# EasyEDA schematic 1-Schematic_Payload Controller.json
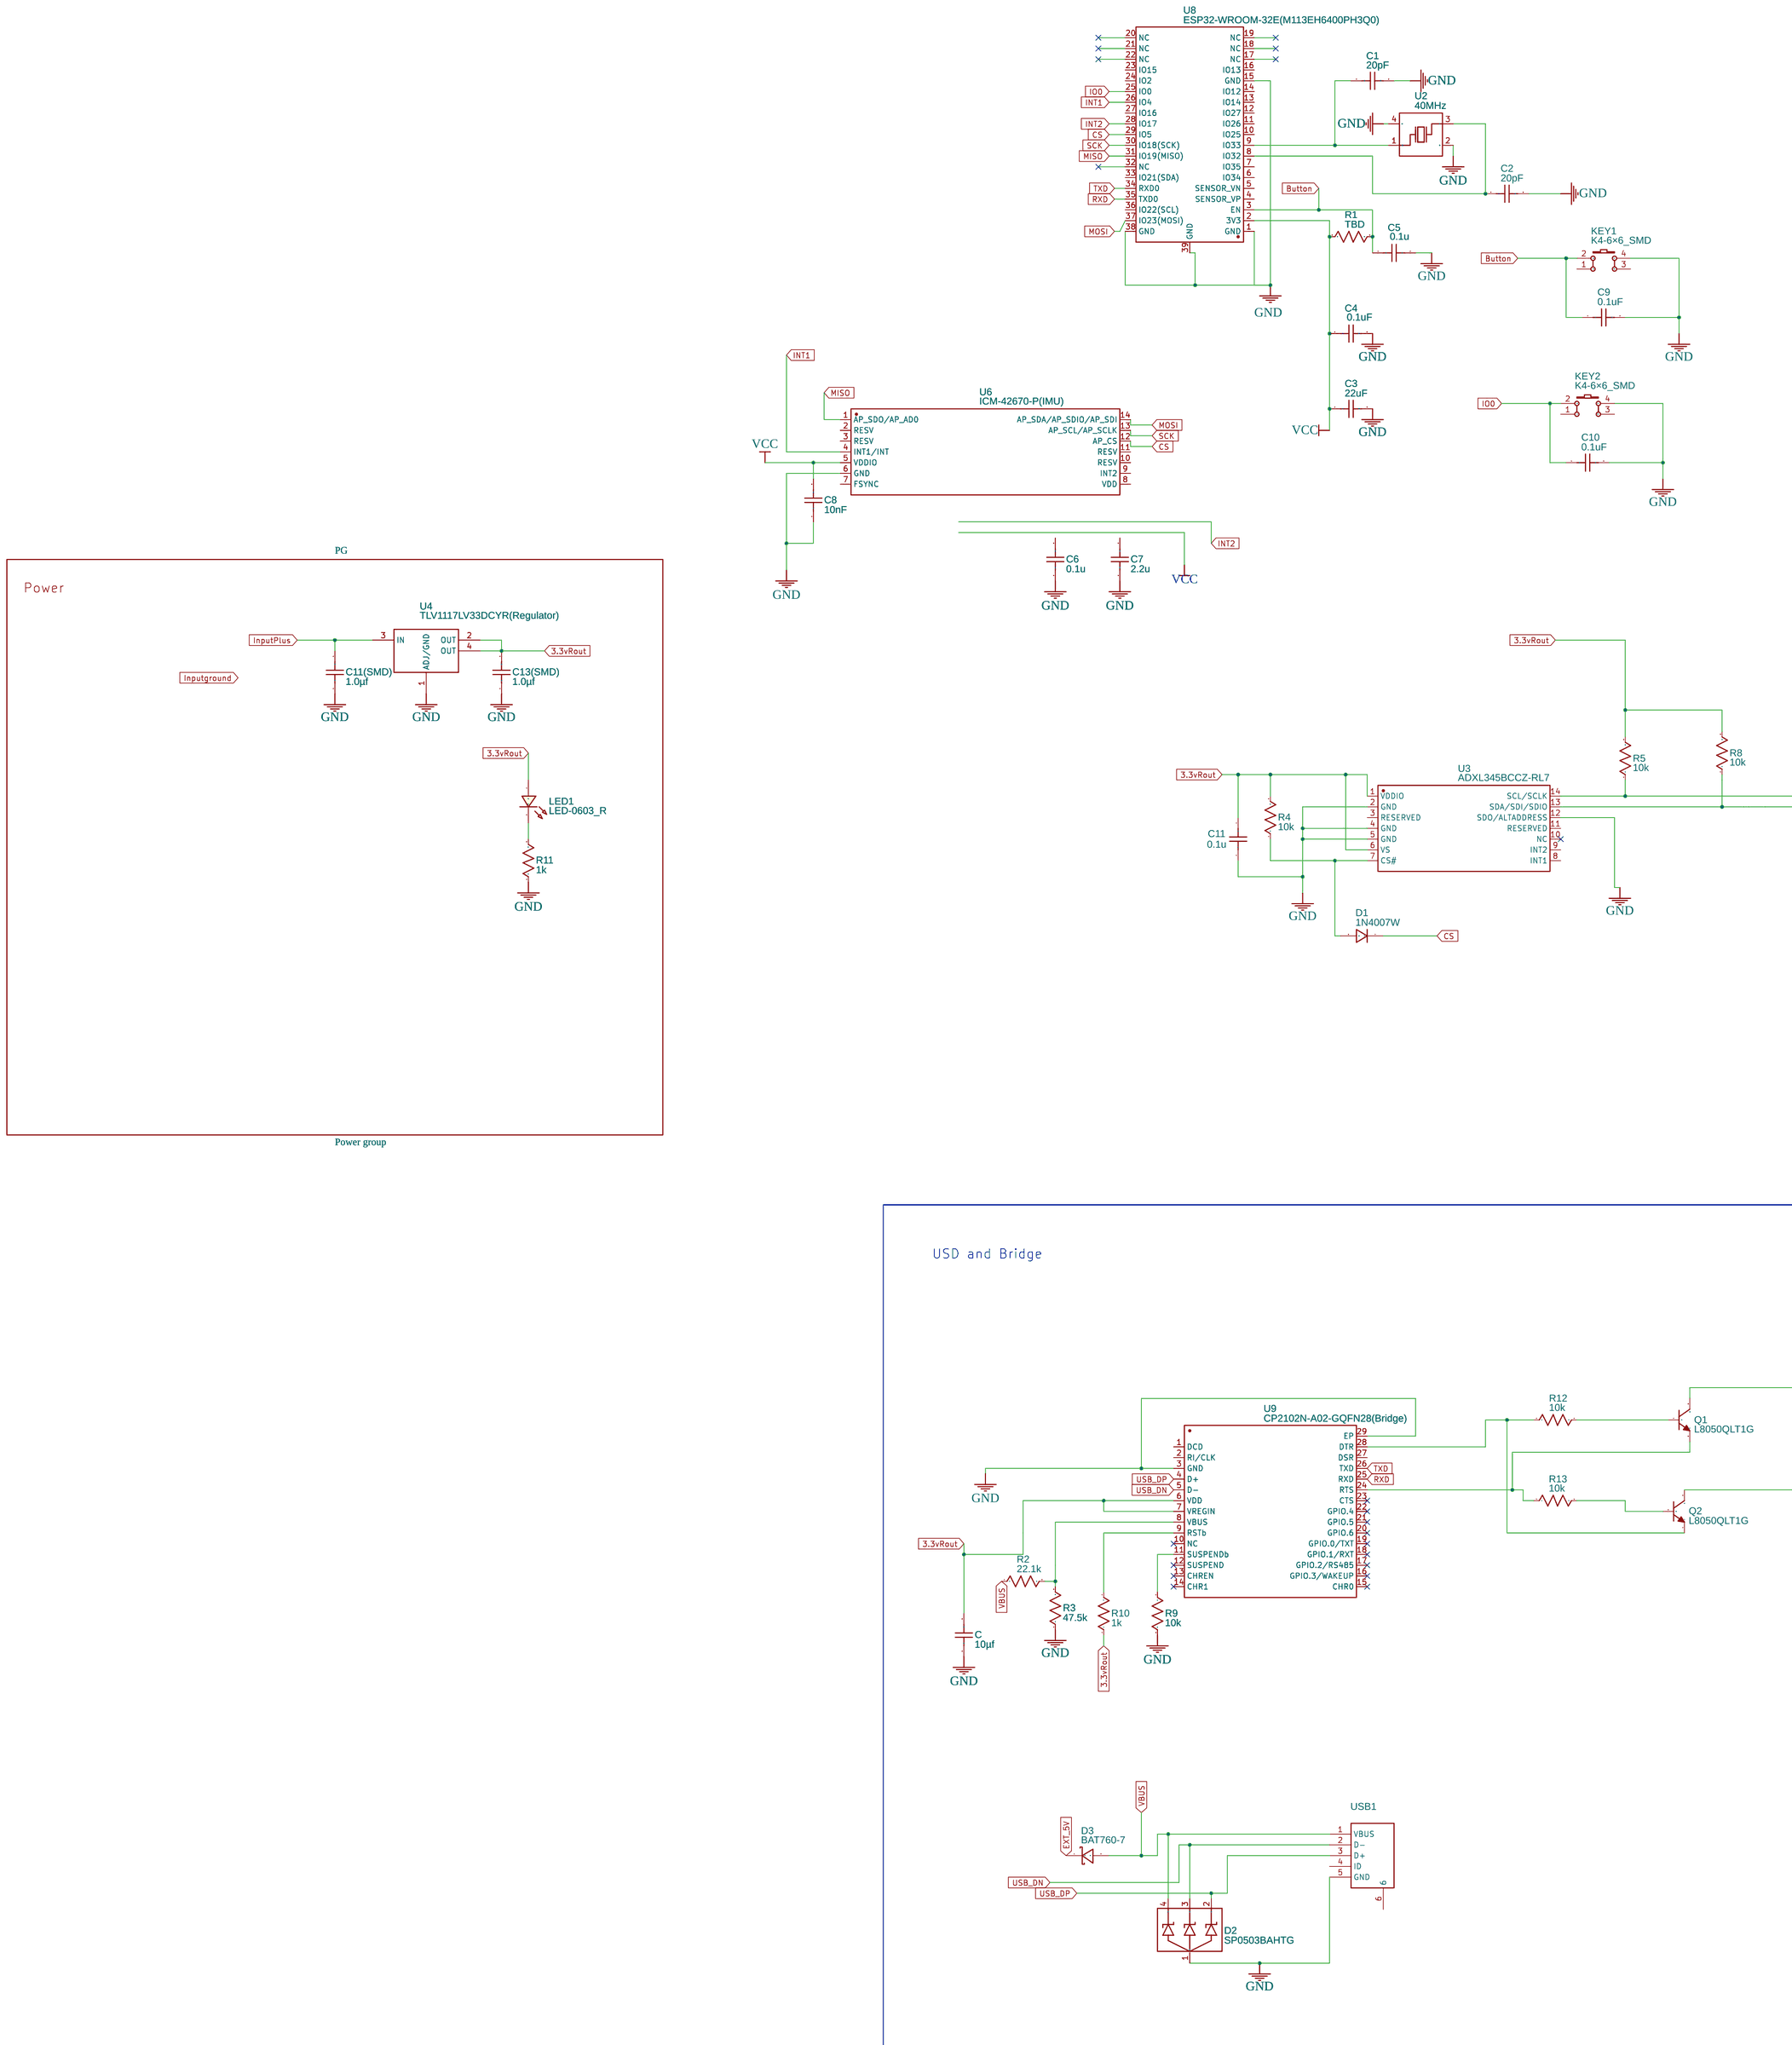
[diagram p0: schematic sheet]

## Parts
C  10µf  [C1206]
C1  20pF  [C0603]
C2  20pF  [C0603]
C3  22uF  [C0603]
C4  0.1uF  [C0603]
C5  0.1u  [C0603]
C6  0.1u  [C0603]
C7  2.2u  [C0603]
C8  10nF  [C0603]
C9  0.1uF  [C0603]
C10  0.1uF  [C0603]
C11  0.1u  [C0603]
C11(SMD)  1.0µf  [C1206]
C13(SMD)  1.0µf  [C1206]
D1  1N4007W  [SOD-123_L2.8-W1.8-LS3.7-RD]
D2  SP0503BAHTG  [SP0503BAHTG]
D3  BAT760-7  [SOD-323_L1.8-W1.3-LS2.5-RD]
KEY1  K4-6×6_SMD  [KEY-SMD_4P-L6.0-W6.0-P3.90-LS10.0]
KEY2  K4-6×6_SMD  [KEY-SMD_4P-L6.0-W6.0-P3.90-LS10.0]
LED1  LED-0603_R  [LED0603_RED]
PG  Power group
Q1  L8050QLT1G  [SOT-23-3_L2.9-W1.3-P1.90-LS2.4-BR]
Q2  L8050QLT1G  [SOT-23-3_L2.9-W1.3-P1.90-LS2.4-BR]
R1  TBD  [R0603]
R2  22.1k  [R1206]
R3  47.5k  [R1206]
R4  10k  [R1206]
R5  10k  [R1206]
R8  10k  [R1206]
R9  10k  [R1206]
R10  1k  [R1206]
R11  1k  [R1206]
R12  10k  [R1206]
R13  10k  [R1206]
U2  40MHz  [OSC-SMD_4P-L2.5-W2.0-BL]
U3  ADXL345BCCZ-RL7  [LGA-14_L5.0-W3.0-P0.80-BL]
U4  TLV1117LV33DCYR(Regulator)  [SOT-223_L6.7-W3.5-P2.30-BR]
U6  ICM-42670-P(IMU)  [LGA-14_L3.0-W2.5-P0.50-TL_QMI8658A]
U8  ESP32-WROOM-32E(M113EH6400PH3Q0)  [WIFI-SMD_ESP32-WROOM-32E]
U9  CP2102N-A02-GQFN28(Bridge)  [QFN-28_L5.0-W5.0-P0.50-TL-EP3.3]
USB1  MICRO5.9MMUSB  [MICRO-USB-SMD_5P-P0.65-H-F_MICRO5.9MMUSB]

## Library data of the parts
C C11(SMD) C13(SMD) = 100UF/25V-CAP_1206: Supplier: LCSC; Supplier Part: C9900034346; Manufacturer: null; Manufacturer Part: 100uF/25V-CAP_1206; Contributor: lcsc; JLCPCB Part Class: Extended Part
C1-C11 = C_0603_US: Contributor: LCEDA_Lib
D1 = 1N4007W: Supplier: LCSC; Supplier Part: C328592; Manufacturer: BLUE ROCKET; Contributor: LCEDA_Lib
D2 = SP0503BAHTG: Contributor: Formule69
D3 = BAT760-7: Contributor: LCSC; Supplier: LCSC; Manufacturer: DIODES(美台); Supplier Part: C124187; JLCPCB Part Class: Extended Part
KEY1 KEY2 = K4-6×6_SMD: Supplier Part: C191626; Supplier: LCSC; Manufacturer: 韩国韩荣; Manufacturer Part: K2-6639SP-D4SC-04; Contributor: LCEDA_Lib
LED1 = LED-0603_R: Manufacturer: EVERLIGHT(台湾亿光); Manufacturer Part: 19-217/R6C-AL1M2VY/3T; Supplier Part: C72044; Supplier: LCSC; Contributor: LCEDA_01
Q1 Q2 = L8050QLT1G: Supplier: LCSC; Manufacturer: LRC(乐山无线电); Supplier Part: C49581; JLCPCB Part Class: Extended Part
R1 = R_0603_US: Contributor: LCEDA_Lib
R2-R5 R8-R13 = R_1206_US: Contributor: LCEDA_Lib
U2 = ECS-400-10-36-CKY-TR: Contributor: lcsc; Supplier: LCSC; Supplier Part: C2449947; Manufacturer: ECS; JLCPCB Part Class: Extended Part
U3 = ADXL345BCCZ-RL7: Supplier: LCSC; Manufacturer: ADI(亚德诺); Supplier Part: C9667; JLCPCB Part Class: Extended Part
U4 = TLV1117LV33DCYR: Supplier: LCSC; Manufacturer: TI(德州仪器); Supplier Part: C15578; JLCPCB Part Class: Extended Part
U6 = ICM-42670-P: Supplier: LCSC; Supplier Part: C3288646; Manufacturer: TDK InvenSense(应美盛); JLCPCB Part Class: Extended Part; Contributor: lcsc
U8 = ESP32-WROOM-32E(M113EH6400PH3Q0): Supplier: LCSC; Supplier Part: C7274980; Manufacturer: ESPRESSIF(乐鑫); Contributor: lcsc; JLCPCB Part Class: Extended Part
U9 = CP2102N-A02-GQFN28: Contributor: LCSC; Supplier: LCSC; Supplier Part: C1550553; Manufacturer: SKYWORKS/SILICON LABS(芯科); JLCPCB Part Class: Extended Part
USB1 = MICRO5.9MMUSB: Contributor: LCSC; Supplier: LCSC; Supplier Part: C393940; Manufacturer: SHOU HAN(首韩); Manufacturer Part: MICRO5.9mmusb

## Nets
3.3vRout: C.2 C11.1 C13(SMD).2 LED1.1 R4.2 R5.2 R8.2 R10.1 U3.1(VDDIO) U3.6(VS) U4.2(OUT) U4.4(OUT) U9.6(VDD) U9.7(VREGIN)
GND: C.1 C1.2 C2.2 C3.2 C4.2 C5.2 C6.1 C7.1 C8.1 C9.2 C10.2 C11.2 C11(SMD).1 C13(SMD).1 D2.1(COMMON) KEY1.4 KEY2.4 R3.1 R9.2 R11.1 U2.2(Gnd) U2.4(Gnd) U3.2(GND) U3.4(GND) U3.5(GND) U3.12(SDO/ALTADDRESS) U4.1(ADJ/GND) U6.6(GND) U8.1(GND) U8.15(GND) U8.38(GND) U8.39(GND) U9.3(GND) U9.29(EP) USB1.5(GND)
VBUS: D2.4(K1) D3.2 R2.1 USB1.1(VBUS)
VCC: C3.1 C4.1 C8.2 R1.1 U6.5(VDDIO) U8.2(3V3)
Button: C5.1 C9.1 KEY1.2 R1.2 U8.3(EN)
CS: D1.1 U6.12(AP_CS) U8.29(IO5)
ESP_RST: Q1.3(C)
EXT_5V: D3.1
InputPlus: C11(SMD).2 U4.3(IN)
INT1: U6.4(INT1/INT) U8.26(IO4)
INT2: U8.28(IO17)
IO0: C10.1 KEY2.2 Q2.3(C) U8.25(IO0)
MISO: U6.1(AP_SDO/AP_AD0) U8.31(IO19(MISO))
MOSI: U6.14(AP_SDA/AP_SDIO/AP_SDI) U8.37(IO23(MOSI))
RXD: U8.35(TXD0) U9.25(RXD)
SCK: U6.13(AP_SCL/AP_SCLK) U8.30(IO18(SCK))
SCL: R8.1 U3.13(SDA/SDI/SDIO)
SDA: R5.1 U3.14(SCL/SCLK)
TXD: U8.34(RXD0) U9.26(TXD)
USB_DN: D2.3(K2) U9.5(D-) USB1.2(D-)
USB_DP: D2.2(K3) U9.4(D+) USB1.3(D+)
Net-(C1-1): C1.1 U2.1(In/Out) U8.9(IO33)
Net-(C2-1): C2.1 U2.3(Out/In) U8.8(IO32)
Net-(D1-2): D1.2 R4.1 U3.7(CS#)
Net-(LED1-2): LED1.2 R11.2
Net-(Q1-1): Q1.1(B) R12.2
Net-(Q1-2): Q1.2(E) R13.1 U9.24(RTS)
Net-(Q2-1): Q2.1(B) R13.2
Net-(Q2-2): Q2.2(E) R12.1 U9.28(DTR)
Net-(R2-2): R2.2 R3.2 U9.8(VBUS)
Net-(R9-1): R9.1 U9.11(SUSPENDb)
Net-(R10-2): R10.2 U9.9(RSTb)

Not connected (* = marked no-connect by the designer): C6 2; C7 2; KEY1 1 3; KEY2 1 3; U3 3(RESERVED) 8(INT1) 9(INT2) 10(NC)* 11(RESERVED); U6 2(RESV) 3(RESV) 7(FSYNC) 8(VDD) 9(INT2) 10(RESV) 11(RESV); U8 4(SENSOR_VP) 5(SENSOR_VN) 6(IO34) 7(IO35) 10(IO25) 11(IO26) 12(IO27) 13(IO14) 14(IO12) 16(IO13) 17(NC) 18(NC) 19(NC) 20(NC) 21(NC) 22(NC) 23(IO15) 24(IO2) 27(IO16) 32(NC) 33(IO21(SDA)) 36(IO22(SCL)); U9 1(DCD) 2(RI/CLK) 10(NC)* 12(SUSPEND)* 13(CHREN)* 14(CHR1)* 15(CHR0)* 16(GPIO.3/WAKEUP)* 17(GPIO.2/RS485)* 18(GPIO.1/RXT)* 19(GPIO.0/TXT)* 20(GPIO.6)* 21(GPIO.5)* 22(GPIO.4)* 23(CTS)* 27(DSR); USB1 4(ID) 6

## Notes on the sheet
- USD and Bridge
